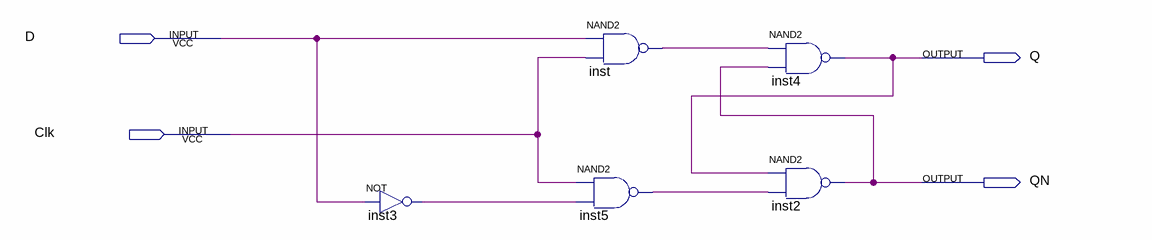
[diagram p0: schematic sheet]
// Quartus schematic lab9step2.bdf as structural Verilog: 5 symbols, 4 pins
module lab9step2 (
  input  D,
  input  Clk,
  output Q,
  output QN
);

  wire inst3_out, inst5_out, inst_out;

  not inst3 (inst3_out, D);
  nand inst (inst_out, D, Clk);
  nand inst5 (inst5_out, Clk, inst3_out);
  nand inst4 (Q, inst_out, QN);
  nand inst2 (QN, Q, inst5_out);
endmodule
